# Altium schematic sheet Versterker.SchDoc: Soldeerstation
size A4; SheetNumber: 3; SheetTotal: 5
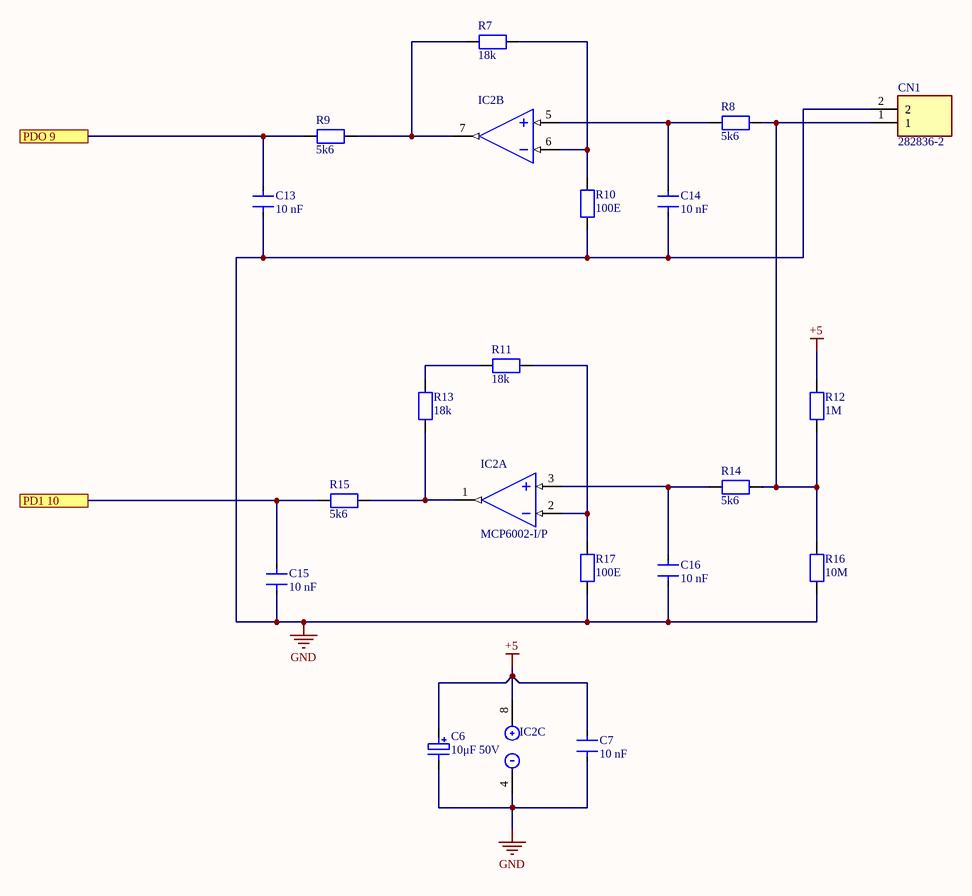
[diagram p0: Versterker.SchDoc]

## Parts
C6  10μF 50V  [Elco 10uF 50V]
C7  10 nF  [0805]
C13  10 nF  [0805]
C14  10 nF  [0805]
C15  10 nF  [0805]
C16  10 nF  [0805]
CN1  282836-2  [Schroefconnector 2 Pin]
IC2  MCP6002-I/P  [Opamp]  (parts A,B,C of 3)
R7  18k  [Resistor]
R8  5k6  [Resistor]
R9  5k6  [Resistor]
R10  100E  [Resistor]
R11  18k  [Resistor]
R12  1M  [Resistor]
R13  18k  [Resistor]
R14  5k6  [Resistor]
R15  5k6  [Resistor]
R16  10M  [Resistor]
R17  100E  [Resistor]

## Ports
PD1 10 (see CPU[3B]), PDO 9 (see CPU[3B])

## Nets
+5: C6.1 C7.2 IC2.8 R12.2
GND: C6.2 C7.1 C13.1 C14.1 C15.1 C16.1 CN1.2 IC2.4 R10.1 R16.1 R17.1
PD1 10: C15.2 R15.2 ; port PD1 10
PDO 9: C13.2 R9.1 ; port PDO 9
NetC14_2: C14.2 IC2.5 R8.1
NetC16_2: C16.2 IC2.3 R14.1
NetCN1_1: CN1.1 R8.2 R12.1 R14.2 R16.2
NetIC2_1: IC2.1 R13.1 R15.1
NetIC2_2: IC2.2 R11.2 R17.2
NetIC2_6: IC2.6 R7.2 R10.2
NetIC2_7: IC2.7 R7.1 R9.2
NetR11_1: R11.1 R13.2

## Library data of the parts
C6 = Condensator Elco: Part Number: 02015A270JAT2A; Manufacturer: AVX Interconnect / Elco
C7 C13-C16 = Condensator 0805: Chip Multilayer Ceramic Capacitors for General Purpose, 0805, 10uF, X5R, 15%, 10%, 25V; Length: 2mm; Depth: 1.25mm; Termination: SMD/SMT; Voltage: 25V; Height: 1.25mm; Material: Ceramic; Thickness: 0.053inch; Radiation Hardening: No; Min Operating Temperature: -55°C; Width: 0.049inch; Package Quantity: 1; Mount: Surface Mount; Dielectric: X5R; Packaging: Tape and Reel; Capacitance: 10uF; Voltage Rating (DC): 25V; Lead Free: Lead Free; Max Operating Temperature: 85°C; Case Code (Imperial): 0805; Case/Package: 0805; Tolerance: 10%; Voltage Rating: 25V; Case Code (Metric): 2012
CN1 = Schroefconnector 2 Pin L: Connector; Manufacturer_Name: TE Connectivity; Datasheet Link: https://www.te.com/commerce/DocumentDelivery/DDEController?Action=showdoc&DocId=Customer+Drawing%7F282836%7FJ%7Fpdf%7FEnglish%7FENG_CD_282836_J.pdf%7F282836-2; Height: 10mm; Manufacturer_Part_Number: 282836-2
IC2 = Opamp: AMP-OPA-MCP6002-IL8; Max Frequency: 1kHz; Operating Supply Current: 100uA; Amplifier Type: GENERAL PURPOSE; Number of Channels: 2; Power Supply Rejection Ratio (PSRR): 86dB; Max Input Voltage: 6V; Bandwidth: 1MHz; Voltage Gain: 112dB; Input Bias Current: 1pA; Slew Rate-Nom: 0.6V/µs; Output Current: 23mA; Input Offset Voltage-Max: 4.5mV; Common Mode Rejection Ratio: 60dB; Min Input Voltage: 1.8V; Operating Supply Voltage: 5.5V; Height: 0.195inch; Number of Circuits: 2; REACH SVHC: No SVHC; Max Supply Voltage: 6V; Supply Current: 100uA; Gain Bandwidth Product: 1MHz; Radiation Hardening: No; Mount: Through Hole; Length: 0.4inch; Number of Pins: 8; Min Operating Temperature: -40°C; Case/Package: PDIP; Number of Amplifiers: 2; RoHS Compliant: Yes; Lead Free: Lead Free; Number of Elements: 2; Technology: CMOS; Width: 0.28inch; Slew Rate: 0.6V/µs; Packaging: Rail/Tube; Output Current per Channel: 23mA; Max Operating Temperature: 85°C; Nominal Supply Current: 100uA; Min Supply Voltage: 1.8V; Input Offset Voltage (Vos): 4.5mV; Unity Gain Bandwidth Product: 1MHz; Package Quantity: 60
R7-R17 = Resistor: Manufacturer: Vishay Dale; Part Number: CRCW08050000Z0EA